# Altium schematic sheet Programmer.SchDoc: Programmer interface (STM32F746-Nucleo)
size A4; Organization: Use Organization_Name in ProjParam; Address1: Eliot Ferragni; Address2: STI-MOBOTS; Address3: EPFL; Address4: CH-1015 LAUSANNE; DocumentNumber: 5; Revision: A; SheetNumber: 5; SheetTotal: 7; ApprovedBy: Init ApprovedBy in DocParam; CheckedBy: Init CheckedBy in DocParam; Author: Init Author in DocParam; CompanyName: Init CompanyName in DocParam; DrawnBy: Init DrawBy in DocParam; Engineer: Init Engineer in DocParam; Title2: + Hall effect current sensors; DocumentName: Init DocumentName in DocParam; ProjectName: Init ProjectName in DocParam
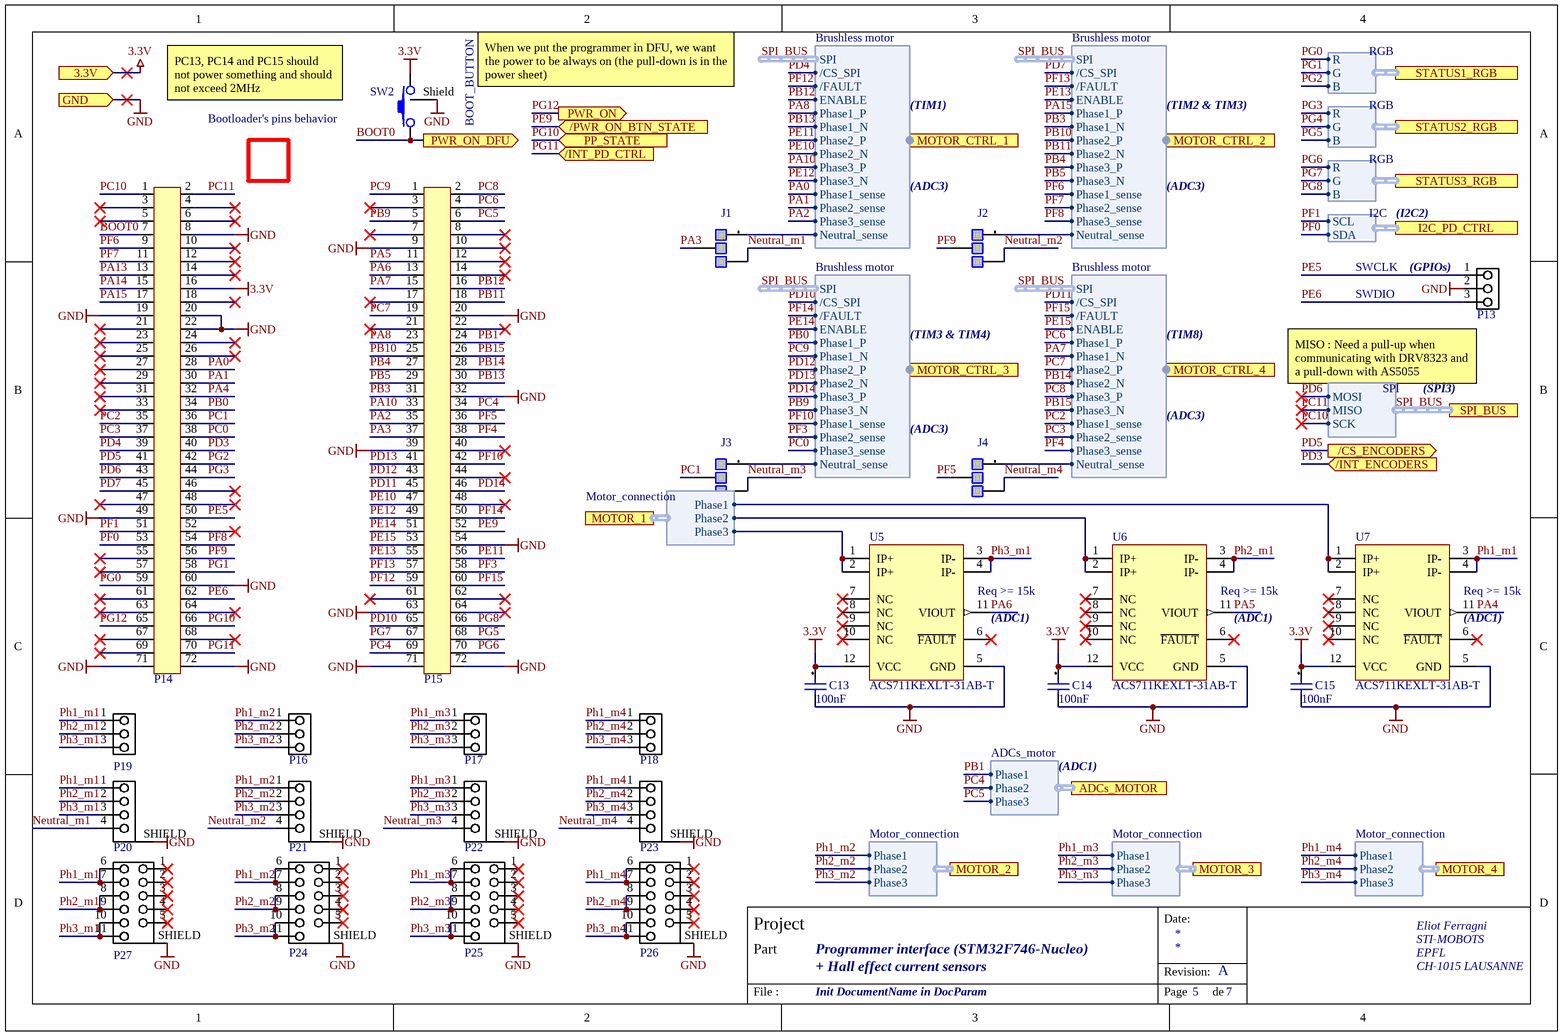
[diagram p0: Programmer.SchDoc]

## Parts
C13  100nF  [CAPC1608X08L]
C14  100nF  [CAPC1608X08L]
C15  100nF  [CAPC1608X08L]
J1  CC_SolderJP3_Micro  [CC_SolderJP3_U]  (value not drawn)  (no BOM)
J2  CC_SolderJP3_Micro  [CC_SolderJP3_U]  (value not drawn)  (no BOM)
J3  CC_SolderJP3_Micro  [CC_SolderJP3_U]  (value not drawn)  (no BOM)
J4  CC_SolderJP3_Micro  [CC_SolderJP3_U]  (value not drawn)  (no BOM)
P13  Header 3  [HEADER1X3-2.54]  (value not drawn)
P14  Header 2x36  [HEADER2x36-2.54]  (value not drawn)
P15  Header 2x36  [HEADER2x36-2.54]  (value not drawn)
P16  3 power pads  [PowerPads 3 pins]  (value not drawn)
P17  3 power pads  [PowerPads 3 pins]  (value not drawn)
P18  3 power pads  [PowerPads 3 pins]  (value not drawn)
P19  3 power pads  [PowerPads 3 pins]  (value not drawn)
P20  MOLEX-52207-0433  [Molex 52207-0433]  (value not drawn)
P21  MOLEX-52207-0433  [Molex 52207-0433]  (value not drawn)
P22  MOLEX-52207-0433  [Molex 52207-0433]  (value not drawn)
P23  MOLEX-52207-0433  [Molex 52207-0433]  (value not drawn)
P24  MOLEX-52207-1133  [Molex 52207-1133]  (value not drawn)
P25  MOLEX-52207-1133  [Molex 52207-1133]  (value not drawn)
P26  MOLEX-52207-1133  [Molex 52207-1133]  (value not drawn)
P27  MOLEX-52207-1133  [Molex 52207-1133]  (value not drawn)
SW2  button  [C&K_KMR2]  (value not drawn)
U5  ACS711KEXLT-31AB-T  [12-PowerWFQFN]
U6  ACS711KEXLT-31AB-T  [12-PowerWFQFN]
U7  ACS711KEXLT-31AB-T  [12-PowerWFQFN]

## Ports
3.3V (in), /CS_ENCODERS (out), /INT_ENCODERS (in), /INT_PD_CTRL (in), /PWR_ON_BTN_STATE (in), ADCs_MOTOR (harness ADCs_motor), GND (in), I2C_PD_CTRL (harness I2C), MOTOR_1 (harness Motor_connection), MOTOR_2 (harness Motor_connection), MOTOR_3 (harness Motor_connection), MOTOR_4 (harness Motor_connection), MOTOR_CTRL_1 (harness Brushless motor), MOTOR_CTRL_2 (harness Brushless motor), MOTOR_CTRL_3 (harness Brushless motor), MOTOR_CTRL_4 (harness Brushless motor), PP_STATE (in), PWR_ON (out), PWR_ON_DFU (out), SPI_BUS (harness SPI), STATUS1_RGB (harness RGB), STATUS2_RGB (harness RGB), STATUS3_RGB (harness RGB)

## Harnesses
RGB: R, G, B
I2C: SDA, SCL
Motor_connection: Phase1, Phase2, Phase3
SPI: MISO, MOSI, SCK
Brushless motor: Phase1_P, Phase1_N, Phase2_P, Phase2_N, Phase3_P, Phase3_N, Phase1_sense, Phase2_sense, Phase3_sense, Neutral_sense, /CS_SPI, SPI, ENABLE, /FAULT
ADCs_motor: Phase1, Phase2, Phase3

## Nets
3.3V: C13.1 C14.1 C15.1 P14.16 SW2.2 U5.12(VCC) U6.12(VCC) U7.12(VCC) ; port 3.3V
GND: C13.2 C14.2 C15.2 P13.2 P14.8 P14.19 P14.20 P14.22 P14.49 P14.60 P14.71 P14.72 P15.9 P15.20 P15.32 P15.39 P15.54 P15.63 P15.71 P15.72 P20.SHIELD P21.SHIELD P22.SHIELD P23.SHIELD P24.SHIELD P25.SHIELD P26.SHIELD P27.SHIELD SW2.Shield U5.5(GND) U6.5(GND) U7.5(GND) ; port GND
BOOT0: P14.7 SW2.1 ; port PWR_ON_DFU
Neutral_m1: J1.3 P20.4
Neutral_m2: J2.3 P21.4
Neutral_m3: J3.3 P22.4
Neutral_m4: J4.3 P23.4
PA0: P14.28 ; port MOTOR_CTRL_1.Phase1_sense
PA1: P14.30 ; port MOTOR_CTRL_1.Phase2_sense
PA2: P15.35 ; port MOTOR_CTRL_1.Phase3_sense
PA3: J1.2 P15.37
PA4: P14.32 U7.11(VIOUT)
PA5: P15.11 U6.11(VIOUT)
PA6: P15.13 U5.11(VIOUT)
PA7: P15.15 ; port MOTOR_CTRL_4.Phase1_N
PA8: P15.23 ; port MOTOR_CTRL_1.Phase1_P
PA10: P15.33 ; port MOTOR_CTRL_1.Phase3_P
PA13: P14.13
PA14: P14.15
PA15: P14.17 ; port MOTOR_CTRL_2.Phase1_P
PB0: P14.34 ; port MOTOR_CTRL_3.Phase1_P
PB1: P15.24 ; port ADCs_MOTOR.Phase1
PB3: P15.31 ; port MOTOR_CTRL_2.Phase1_N
PB4: P15.27 ; port MOTOR_CTRL_2.Phase3_P
PB5: P15.29 ; port MOTOR_CTRL_2.Phase3_N
PB9: P15.5 ; port MOTOR_CTRL_3.Phase3_N
PB10: P15.25 ; port MOTOR_CTRL_2.Phase2_P
PB11: P15.18 ; port MOTOR_CTRL_2.Phase2_N
PB12: P15.16 ; port MOTOR_CTRL_1.ENABLE
PB13: P15.30 ; port MOTOR_CTRL_1.Phase1_N
PB14: P15.28 ; port MOTOR_CTRL_4.Phase2_N
PB15: P15.26 ; port MOTOR_CTRL_4.Phase3_N
PC0: P14.38 ; port MOTOR_CTRL_3.Phase3_sense
PC1: J3.2 P14.36
PC2: P14.35 ; port MOTOR_CTRL_4.Phase1_sense
PC3: P14.37 ; port MOTOR_CTRL_4.Phase2_sense
PC4: P15.34 ; port ADCs_MOTOR.Phase2
PC5: P15.6 ; port ADCs_MOTOR.Phase3
PC6: P15.4 ; port MOTOR_CTRL_4.Phase1_P
PC7: P15.19 ; port MOTOR_CTRL_4.Phase2_P
PC8: P15.2 ; port MOTOR_CTRL_4.Phase3_P
PC9: P15.1 ; port MOTOR_CTRL_3.Phase1_N
PC10: P14.1 ; port SPI_BUS.SCK
PC11: P14.2 ; port SPI_BUS.MISO
PD3: P14.40 ; port /INT_ENCODERS
PD4: P14.39 ; port MOTOR_CTRL_1./CS_SPI
PD5: P14.41 ; port /CS_ENCODERS
PD6: P14.43 ; port SPI_BUS.MOSI
PD7: P14.45 ; port MOTOR_CTRL_2./CS_SPI
PD10: P15.65 ; port MOTOR_CTRL_3./CS_SPI
PD11: P15.45 ; port MOTOR_CTRL_4./CS_SPI
PD12: P15.43 ; port MOTOR_CTRL_3.Phase2_P
PD13: P15.41 ; port MOTOR_CTRL_3.Phase2_N
PD14: P15.46 ; port MOTOR_CTRL_3.Phase3_P
PE5: P13.1 P14.50
PE6: P13.3 P14.62
PE9: P15.52 ; port /PWR_ON_BTN_STATE
PE10: P15.47 ; port MOTOR_CTRL_1.Phase2_N
PE11: P15.56 ; port MOTOR_CTRL_1.Phase2_P
PE12: P15.49 ; port MOTOR_CTRL_1.Phase3_N
PE13: P15.55 ; port MOTOR_CTRL_2.ENABLE
PE14: P15.51 ; port MOTOR_CTRL_3.ENABLE
PE15: P15.53 ; port MOTOR_CTRL_4.ENABLE
PF0: P14.53 ; port I2C_PD_CTRL.SDA
PF1: P14.51 ; port I2C_PD_CTRL.SCL
PF3: P15.58 ; port MOTOR_CTRL_3.Phase2_sense
PF4: P15.38 ; port MOTOR_CTRL_4.Phase3_sense
PF5: J4.2 P15.36
PF6: P14.9 ; port MOTOR_CTRL_2.Phase1_sense
PF7: P14.11 ; port MOTOR_CTRL_2.Phase2_sense
PF8: P14.54 ; port MOTOR_CTRL_2.Phase3_sense
PF9: J2.2 P14.56
PF10: P15.42 ; port MOTOR_CTRL_3.Phase1_sense
PF12: P15.59 ; port MOTOR_CTRL_1./FAULT
PF13: P15.57 ; port MOTOR_CTRL_2./FAULT
PF14: P15.50 ; port MOTOR_CTRL_3./FAULT
PF15: P15.60 ; port MOTOR_CTRL_4./FAULT
PG0: P14.59 ; port STATUS1_RGB.R
PG1: P14.58 ; port STATUS1_RGB.G
PG2: P14.42 ; port STATUS1_RGB.B
PG3: P14.44 ; port STATUS2_RGB.R
PG4: P15.69 ; port STATUS2_RGB.G
PG5: P15.68 ; port STATUS2_RGB.B
PG6: P15.70 ; port STATUS3_RGB.R
PG7: P15.67 ; port STATUS3_RGB.G
PG8: P15.66 ; port STATUS3_RGB.B
PG10: P14.66 ; port PP_STATE
PG11: P14.70 ; port /INT_PD_CTRL
PG12: P14.65 ; port PWR_ON
Ph1_m1: P19.1 P20.1 P27.6 P27.7 U7.3(IP-) U7.4(IP-)
Ph1_m2: P16.1 P21.1 P24.6 P24.7 ; port MOTOR_2.Phase1
Ph1_m3: P17.1 P22.1 P25.6 P25.7 ; port MOTOR_3.Phase1
Ph1_m4: P18.1 P23.1 P26.6 P26.7 ; port MOTOR_4.Phase1
Ph2_m1: P19.2 P20.2 P27.8 P27.9 U6.3(IP-) U6.4(IP-)
Ph2_m2: P16.2 P21.2 P24.8 P24.9 ; port MOTOR_2.Phase2
Ph2_m3: P17.2 P22.2 P25.8 P25.9 ; port MOTOR_3.Phase2
Ph2_m4: P18.2 P23.2 P26.8 P26.9 ; port MOTOR_4.Phase2
Ph3_m1: P19.3 P20.3 P27.10 P27.11 U5.3(IP-) U5.4(IP-)
Ph3_m2: P16.3 P21.3 P24.10 P24.11 ; port MOTOR_2.Phase3
Ph3_m3: P17.3 P22.3 P25.10 P25.11 ; port MOTOR_3.Phase3
Ph3_m4: P18.3 P23.3 P26.10 P26.11 ; port MOTOR_4.Phase3
NetJ1_1: J1.1 ; port MOTOR_CTRL_1.Neutral_sense
NetJ2_1: J2.1 ; port MOTOR_CTRL_2.Neutral_sense
NetJ3_1: J3.1 ; port MOTOR_CTRL_3.Neutral_sense
NetJ4_1: J4.1 ; port MOTOR_CTRL_4.Neutral_sense
NetU5_1: U5.1(IP+) U5.2(IP+) ; port MOTOR_1.Phase3
NetU6_1: U6.1(IP+) U6.2(IP+) ; port MOTOR_1.Phase2
NetU7_1: U7.1(IP+) U7.2(IP+) ; port MOTOR_1.Phase1

Not connected (* = marked no-connect by the designer): P14 3* 4* 5* 6* 10* 12* 14* 18* 21* 23* 24* 25* 26* 27* 29* 31* 33* 46* 47* 48* 52(51)* 55(52)* 57(53)* 61(55)* 63(56)* 64(57)* 67(58)* 68(59)* 69(59)*; P15 3* 7* 8* 10* 12* 14* 17* 21* 22* 40* 44* 48* 61(55)* 62(56)* 64(57)*; P24 1* 2* 3* 4* 5*; P25 1* 2* 3* 4* 5*; P26 1* 2* 3* 4* 5*; P27 1* 2* 3* 4* 5*; U5 6(~{FAULT})* 7(NC)* 8(NC)* 9(NC)* 10(NC)*; U6 6(~{FAULT})* 7(NC)* 8(NC)* 9(NC)* 10(NC)*; U7 6(~{FAULT})* 7(NC)* 8(NC)* 9(NC)* 10(NC)*

## Buses and harness runs
harness SPI_BUS = port SPI_BUS

## Notes on the sheet
- PC13, PC14 and PC15 should not power something and should not exceed 2MHz
- When we put the programmer in DFU, we want the power to be always on (the pull-down is in the power sheet)
- (TIM1)
- (TIM2 & TIM3)
- (near SW2) Bootloader's pins behavior
- BOOT_BUTTON
- (near J2) (ADC3)
- (ADC3)
- (I2C2)
- SWCLK
- SWDIO
- (near P13) (GPIOs)
- (TIM3 & TIM4)
- (TIM8)
- (near P13) MISO : Need a pull-up when communicating with DRV8323 and a pull-down with AS5055
- (near J4) (ADC3)
- (SPI3)
- Bootloader's pins behavior :
  USART1 :
  PA10 (RX) set as input 	-> connected to Phase3_P motor1 with pull-down				=> OK
  PA9 (TX) set as output high	-> connected to VBus							=> OK
  USART3:
  PB11 (RX) set as input	-> connected to Phase2_N motor2 with pull-down				=> OK
  PB10 (TX) set as output high	-> connected to Phase2_P motor2 with pull-down				=> not really a problem because all other transistors of this motor are OFF
  PC11 (RX) set as input	-> connected to MISO SPI_ENCODERS					=> OK
  PC10 (TX) set as output high	-> connected to SCK of SPI_ENCODERS					=> OK
  CAN2 (slave):
  PB5 (RX) set as input		-> connected to Phase3_N motor2 with pull-down				=> OK
  PB13 (TX) set as output high	-> connected to Phase1_N motor1 with pull-down				=> not really a problem because all other transistors of this motor are OFF
  I2C1 (slave):
  PB6 (SCL) set as open-drain	-> not connected							=> OK
  PB9 (SDA) set as open-drain	-> connected to Phase3_N with pull-down					=> OK
  I2C2 (slave):
  PF1 (SCL) set as open-drain	-> connected to SCL of I2C_pd_controller with pull-up				=> OK
  PF0 (SDA) set as open-drain	-> connected to SDA of I2C_pd_controller with pull-up				=> OK
  I2C3 (slave):
  PA8 (SCL) set as open-drain	-> connected to Phase1_P motor1 with pull-down				=> OK
  PC9 (SDA) set as open-drain	-> connected to Phase1_N motor3 with pull-down				=> OK
  USB (DFU):
  PA11 (DM)		-> connected to USB connector on the Nucleo Board				=> OK
  PA12 (DP) (no pull-up needed)	-> connected to USB connector on the Nucleo Board				=> OK
- (near U5) Req >= 15k
- (near U5) (ADC1)
- (near U6) Req >= 15k
- (near U6) (ADC1)
- (near U7) Req >= 15k
- (near U7) (ADC1)
- (ADC1)
- Date:
- Project
- Part
- Revision:
- File :
- Page
- de

## Library data of the parts
C13-C15 = TBD Capacitor[[/\]]0603[[/\]]1: Capacitor TBD 0603; Preference: 1; Currentie: CHF; Size: 0603; Footprint Acort: 0603_G; ROHS: True; DateLastUpdate: 2012-11-19 / 14:36:40
J1-J4 = CC_SolderJP3_Micro: Micro Solder Jumper 3 leads; Preference: 1; Footprint Acort: ToDefine; DateLastUpdate: 2008-02-26 / 09:57:0
P13 = Header 3: Header, 3-Pin; Manufacturer: Generic Components; Class I: Connector; Revision: July-2002: Re-released for DXP Platform.; Publisher: Altium Limited
P16-P19 = 3 power pads: 3-Pin; Manufacturer: Generic Components; Class I: Connector; Revision: July-2002: Re-released for DXP Platform.; Publisher: Altium Limited
SW2 = C&K KMR2: KMR221GLFS; Manufacturer: Tyco; Manufacturer Nr: 7-188275-6; Preference: 1; Currentie: CHF; Quant_1: 10; Quant_2: 900; Circuit: SPST-NO; Switch Function: Off-Mom; Contact Rating @ Voltage: 0.05A @ 32VDC; Actuator Type: Standard; Actuator Height off PCB, from Pins: 1.90mm; Actuator Orientation: Top Actuated; Outline: 4.60mm x 2.80mm; Illumination: Non-Illuminated; Operating Force: 200gf; Switch Travel: 0.25mm; Mechanical Life: 200,000 Cycles; Footprint Acort: ToDefine; ComponentLink1Description: Datasheet; ComponentLink1URL: http://ecommas.tycoelectronics.com/commerce/DocumentDelivery/DDEController?Action=showdoc&DocId=Customer+Drawing%7F188275%7FR%7Fpdf%7FEnglish%7FC_188275_R.pdf; Supplier: Farnell; Supplier Nr: 1056234; ComponentLink2Description: Farnell link; ComponentLink2URL: http://fr.farnell.com/jsp/displayProduct.jsp?sku=1056234; ROHS: True; Type: SMD; Orientation: Vertical; DateLastUpdate: 2007-12-04 / 09:15:57; Price_1: 1,1; Price_2: 0,924; Supplier 1: Digi-Key; Manufacturer Part Number: KMR221GLFS; Category: Switches; Stock 1: 20549; Pricing 1: 1=0.51, 10=0.493, 25=0.484, 50=0.4656, 100=0.4017, 250=0.3652, 500=0.34694, 1000=0.2739 (USD); Packaging: Cut Tape (CT); Mounting Type: Surface Mount; Termination Style: Gull Wing; Illumination Voltage (Nominal): -; Illumination Type, Color: -; Ingress Protection: -; Features: Grounding Pin; Actuator Material: -; Operating Temperature: -40°C ~ 85°C; ComponentLink3URL: http://www.ck-components.com/index.php?module=media&action=Display&cmpref=14414&lang=en&width=&height=&format=&alt=; ComponentLink3Description: http://www.ck-components.com/index.php?module=media&action=Display&cmpref=14414&lang=en&width=&height=&format=&alt=; Supplier Part Number 1: 401-1427-1-ND
U5-U7 = ACS711KEXLT-31AB-T: Hall Effect Linear Current Sensor with Overcurrent Fault Output for <100 V Isolation Applications, 3 to 5.5 V, -31 to 31 A IP, -40 to 125 degC, 12-Pin QFN (EX), RoHS, Tape and Reel; VCC Max: 5.5 V; IP Max: 31A; VCC Min: 3 V; IP Min: -31 A; -3dB Bandwidth: 0.1 MHz; PackageDescription: 12-Pin Quad Flat No-Lead, Body 3 x 3 mm, Height 0.8 mm; ComponentLink1URL: http://www.allegromicro.com/; Packing: Tape and Reel; ComponentLink2URL: http://www.allegromicro.com/~/media/Files/Datasheets/ACS711-Datasheet.ashx?la=en; DatasheetVersion: Rev. 4; PartNumber: ACS711KEXLT-31AB-T; ComponentLink2Description: Datasheet; ComponentLink3URL: http://www.allegromicro.com/~/media/Files/Datasheets/ACS711-Datasheet.ashx?la=en; RoHS: TRUE; ComponentLink1Description: Manufacturer URL; ComponentLink3Description: Package Specification; Temperature Max: 125 degC; Mounting Technology: Surface Mount; Temperature Min: -40 degC